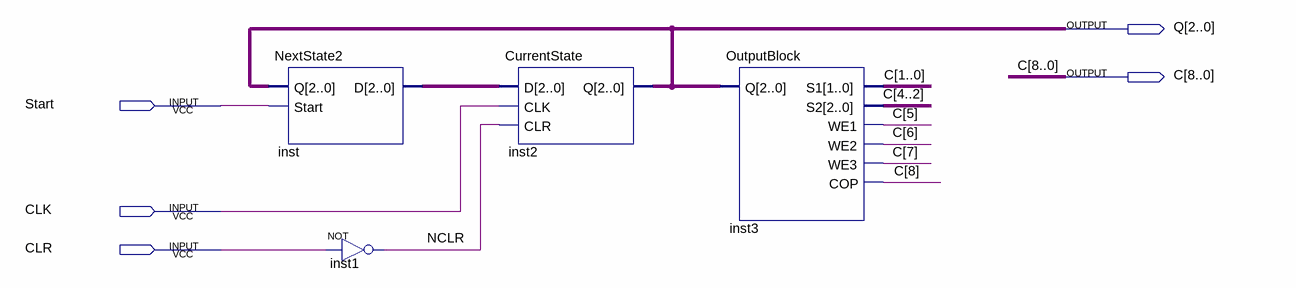
[diagram p0: schematic sheet]
// Quartus schematic Control.bdf as structural Verilog: 4 symbols, 5 pins
module Control (
  input  Start,
  input  CLK,
  input  CLR,
  output [2:0] Q,
  output [8:0] C
);

  wire NCLR;
  wire [2:0] inst_d;

  NextState2 inst (.Q(Q), .Start(Start), .D(inst_d));
  not inst1 (NCLR, CLR);
  CurrentState inst2 (.D(inst_d), .CLK(CLK), .CLR(NCLR), .Q(Q));
  OutputBlock inst3 (.Q(Q), .S1(C[1:0]), .S2(C[4:2]), .WE1(C[5]), .WE2(C[6]), .WE3(C[7]), .COP(C[8]));
endmodule
